# Altium schematic sheet OSP_Carrier_V8_Misc.SchDoc: OSP_Carrier_V8
size B; ApprovedBy: HARI; Engineer: LP; Organization: THE_Lab; DocumentNumber: 1; Revision: 1; SheetNumber: 1; SheetTotal: 1
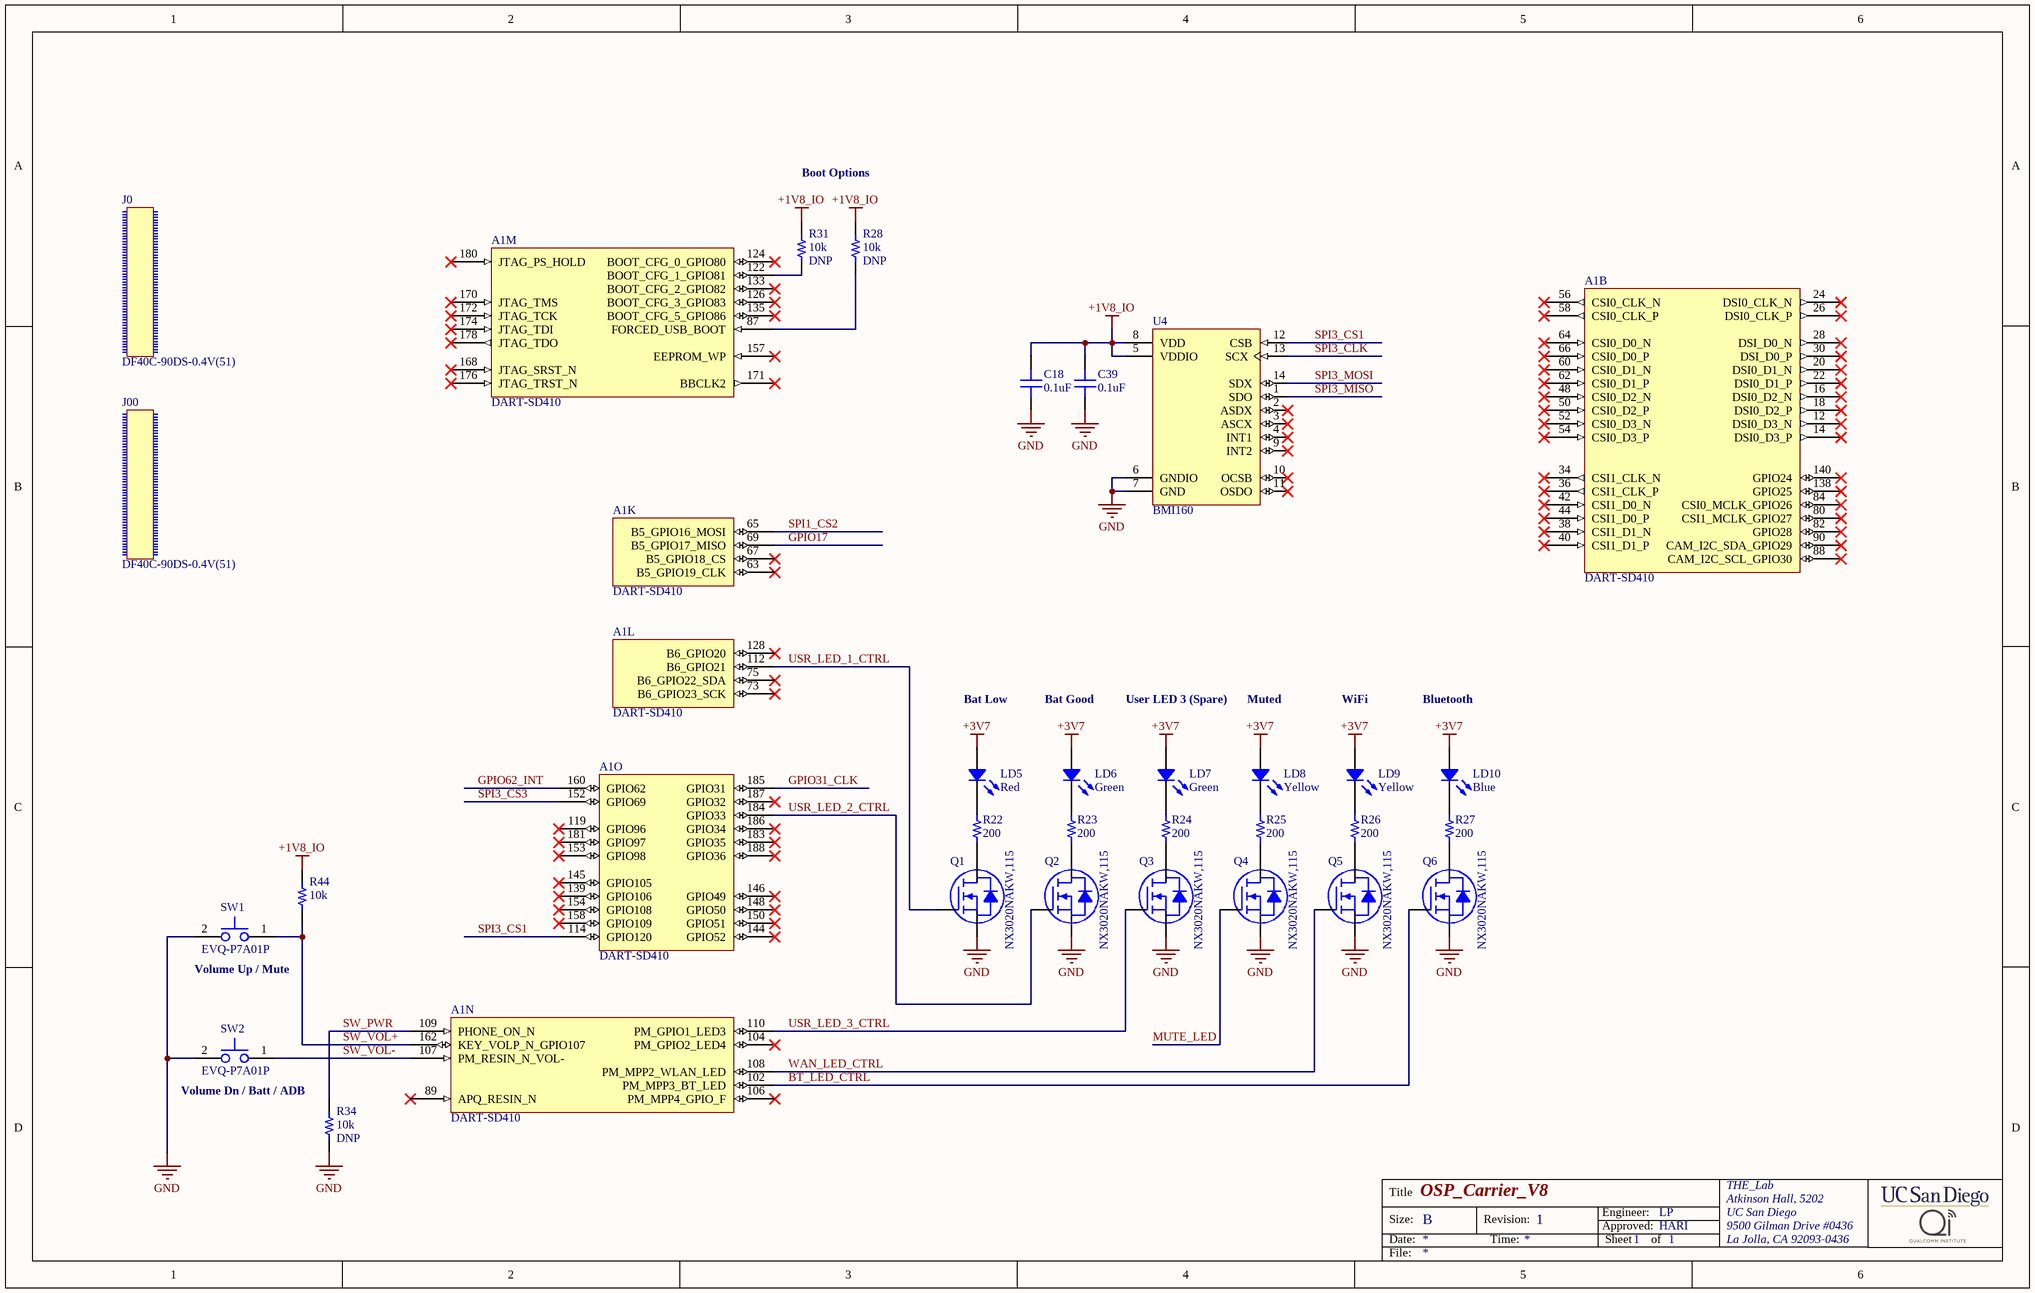
[diagram p0: OSP_Carrier_V8_Misc.SchDoc]

## Parts
A1  DART-SD410  [DART-SD410]  (parts B,K,L,M,N,O of 15)
C18  0.1uF  [CAP 0402/1005]
C39  0.1uF  [CAP 0402/1005]
J0  DF40C-90DS-0.4V(51)  [Hirose_DF40C-90DS-0.4V(51)]
J00  DF40C-90DS-0.4V(51)  [Hirose_DF40C-90DS-0.4V(51)]
LD5  Red  [LED 0603/1608 RED]
LD6  Green  [LED 0603/1608 GREEN]
LD7  Green  [LED 0603/1608 GREEN]
LD8  Yellow  [LED 0603/1608 YELLOW]
LD9  Yellow  [LED 0603/1608 YELLOW]
LD10  Blue  [LED 0603/1608 BLUE]
Q1  NX3020NAKW,115  [NXP SOT-323-3]
Q2  NX3020NAKW,115  [NXP SOT-323-3]
Q3  NX3020NAKW,115  [NXP SOT-323-3]
Q4  NX3020NAKW,115  [NXP SOT-323-3]
Q5  NX3020NAKW,115  [NXP SOT-323-3]
Q6  NX3020NAKW,115  [NXP SOT-323-3]
R22  200  [RES 0402/1005]
R23  200  [RES 0402/1005]
R24  200  [RES 0402/1005]
R25  200  [RES 0402/1005]
R26  200  [RES 0402/1005]
R27  200  [RES 0402/1005]
R28  10k  [RES 0402/1005]
R31  10k  [RES 0402/1005]
R34  10k  [RES 0402/1005]
R44  10k  [RES 0402/1005]
SW1  EVQ-P7A01P  [PANASONIC_EVQ-P7A]
SW2  EVQ-P7A01P  [PANASONIC_EVQ-P7A]
U4  BMI160  [BOSCH_LGA14]

## Nets
+1V8_IO: C18.1 C39.1 R28.2 R31.2 R44.2 U4.5(VDDIO) U4.8(VDD)
+3V7: LD5.1 LD6.1 LD7.1 LD8.1 LD9.1 LD10.1
GND: C18.2 C39.2 Q1.3(S) Q2.3(S) Q3.3(S) Q4.3(S) Q5.3(S) Q6.3(S) R34.1 SW1.2 SW2.2 U4.6(GNDIO) U4.7(GND)
BT_LED_CTRL: A1.102(PM_MPP3_BT_LED) Q6.1(G)
GPIO17: A1.69(B5_GPIO17_MISO)
GPIO31_CLK: A1.185(GPIO31)
GPIO62_INT: A1.160(GPIO62)
MUTE_LED: Q4.1(G)
SPI1_CS2: A1.65(B5_GPIO16_MOSI)
SPI3_CLK: U4.13(SCX)
SPI3_CS1: A1.114(GPIO120) U4.12(CSB)
SPI3_CS3: A1.152(GPIO69)
SPI3_MISO: U4.1(SDO)
SPI3_MOSI: U4.14(SDX)
SW_PWR: A1.109(PHONE_ON_N) R34.2
SW_VOL+: A1.162(KEY_VOLP_N_GPIO107) R44.1 SW1.1
SW_VOL-: A1.107(PM_RESIN_N_VOL-) SW2.1
USR_LED_1_CTRL: A1.112(B6_GPIO21) Q1.1(G)
USR_LED_2_CTRL: A1.184(GPIO33) Q2.1(G)
USR_LED_3_CTRL: A1.110(PM_GPIO1_LED3) Q3.1(G)
WAN_LED_CTRL: A1.108(PM_MPP2_WLAN_LED) Q5.1(G)
NetA1_87: A1.87(FORCED_USB_BOOT) R28.1
NetA1_122: A1.122(BOOT_CFG_1_GPIO81) R31.1
NetLD5_2: LD5.2 R22.2
NetLD6_2: LD6.2 R23.2
NetLD7_2: LD7.2 R24.2
NetLD8_2: LD8.2 R25.2
NetLD9_2: LD9.2 R26.2
NetLD10_2: LD10.2 R27.2
NetQ1_2: Q1.2(D) R22.1
NetQ2_2: Q2.2(D) R23.1
NetQ3_2: Q3.2(D) R24.1
NetQ4_2: Q4.2(D) R25.1
NetQ5_2: Q5.2(D) R26.1
NetQ6_2: Q6.2(D) R27.1

Not connected (* = marked no-connect by the designer): A1 12(DSI0_D3_N)* 14(DSI0_D3_P)* 16(DSI0_D2_N)* 18(DSI0_D2_P)* 20(DSI0_D1_N)* 22(DSI0_D1_P)* 24(DSI0_CLK_N)* 26(DSI0_CLK_P)* 28(DSI_D0_N)* 30(DSI_D0_P)* 34(CSI1_CLK_N)* 36(CSI1_CLK_P)* 38(CSI1_D1_N)* 40(CSI1_D1_P)* 42(CSI1_D0_N)* 44(CSI1_D0_P)* 48(CSI0_D2_N)* 50(CSI0_D2_P)* 52(CSI0_D3_N)* 54(CSI0_D3_P)* 56(CSI0_CLK_N)* 58(CSI0_CLK_P)* 60(CSI0_D1_N)* 62(CSI0_D1_P)* 63(B5_GPIO19_CLK)* 64(CSI0_D0_N)* 66(CSI0_D0_P)* 67(B5_GPIO18_CS)* 73(B6_GPIO23_SCK)* 75(B6_GPIO22_SDA)* 80(CSI1_MCLK_GPIO27)* 82(GPIO28)* 84(CSI0_MCLK_GPIO26)* 88(CAM_I2C_SCL_GPIO30)* 89(APQ_RESIN_N)* 90(CAM_I2C_SDA_GPIO29)* 104(PM_GPIO2_LED4)* 106(PM_MPP4_GPIO_F)* 119(GPIO96)* 124(BOOT_CFG_0_GPIO80)* 126(BOOT_CFG_3_GPIO83)* 128(B6_GPIO20)* 133(BOOT_CFG_2_GPIO82)* 135(BOOT_CFG_5_GPIO86)* 138(GPIO25)* 139(GPIO106)* 140(GPIO24)* 144(GPIO52)* 145(GPIO105)* 146(GPIO49)* 148(GPIO50)* 150(GPIO51)* 153(GPIO98)* 154(GPIO108)* 157(EEPROM_WP)* 158(GPIO109)* 168(JTAG_SRST_N)* 170(JTAG_TMS)* 171(BBCLK2)* 172(JTAG_TCK)* 174(JTAG_TDI)* 176(JTAG_TRST_N)* 178(JTAG_TDO)* 180(JTAG_PS_HOLD)* 181(GPIO97)* 183(GPIO35)* 186(GPIO34)* 187(GPIO32)* 188(GPIO36)*; U4 2(ASDX)* 3(ASCX)* 4(INT1)* 9(INT2)* 10(OCSB)* 11(OSDO)*

## Notes on the sheet
- Boot Options
- Bat Low
- Bat Good
- User LED 3 (Spare)
- Muted
- WiFi
- Bluetooth
- (near SW1) Volume Up / Mute
- Volume Dn / Batt / ADB
- Title
- Size:
- Date:
- B
- Revision:
- Time:
- Engineer:
- Approved:
- Sheet
- of
- THE_Lab
- Atkinson Hall, 5202
- UC San Diego
- 9500 Gilman Drive #0436
- La Jolla, CA 92093-0436
- File:

## Library data of the parts
A1 = DART-SD410: Variscite DART-SD410 System on Module
C18 C39 = C1005X7R1H104K050BB: CAP CER 0.1UF 50V X7R 0402; Manufacturer: TDK Corporation; TemperatureRange: -55C ~ 125C; Tolerance: 10%; Value: 0.1uF; Part Number: C1005X7R1H104K050BB; PartId: 3860; Supplier 1: Digi-Key; Supplier Part Number 1: 445-5932-2-ND; ComponentLink1Description: Datasheet; ComponentLink1URL: https://product.tdk.com/info/en/catalog/datasheets/mlcc_commercial_general_en.pdf; ComponentLink2Description: Digi-Key listing; ComponentLink2URL: http://digikey.com/product-detail/en/C1005X7R1H104K050BB/445-5932-2-ND/2443410; TemperatureCoefficient: X7R; Voltage: 50V; Price: 0.0287; Type: -; Device Package: 0402 (1005 Metric)
J0 J00 = Dummy_Hirose_SoM_Connector: Hirose DF40C-90DS-0.4V(51) Board-to-Board Connector
LD5 = LTST-C191KRKT: LED RED CLEAR 0603 SMD; Manufacturer: Lite-On Inc.; Value: Green; Millicandela: 54mcd; Voltage Forward: 2V; Current (Test): 20mA; Viewing Angle: 130; Part Number: LTST-C191KRKT; PartId: 7050; Supplier 1: Digi-Key; Supplier Part Number 1: 160-1447-2-ND; ComponentLink1Description: Datasheet; ComponentLink1URL: http://optoelectronics.liteon.com/upload/download/DS22-2000-223/S_110_LTST-C191KRKT.pdf; ComponentLink2Description: Digi-Key Listing; ComponentLink2URL: http://www.digikey.ca/product-detail/en/LTST-C191KRKT/160-1447-2-ND/386837; Price: 0.0521; Device Package: 0603 (1608 Metric); Colour: Red; Lens Transparency: Clear
LD6 LD7 = LTST-C191KGKT: LED GREEN CLEAR 0603 SMD; Manufacturer: Lite-On Inc.; Type: Surface Mount; Millicandela: 35mcd; Voltage Forward: 2V; Current (Test): 20mA; Viewing Angle: 130; Value: Green; Part Number: LTST-C191KGKT; PartId: 7051; Supplier 1: Digi-Key; Supplier Part Number 1: 160-1446-2-ND; ComponentLink1Description: Datasheet; ComponentLink1URL: http://optoelectronics.liteon.com/upload/download/DS22-2000-228/S_110_LTST-C191KGKT.pdf; ComponentLink2Description: Digi-Key Listing; ComponentLink2URL: http://www.digikey.ca/product-detail/en/LTST-C191KGKT/160-1446-2-ND/386835; Price: 0.0521; Device Package: 0603 (1608 Metric); Colour: Green; Lens Transparency: Clear
LD8 LD9 = LTST-C191KSKT: LED YELLOW CLEAR 0603 SMD; Manufacturer: Lite-On Inc.; Value: Green; Type: Surface Mount; Millicandela: 104mcd; Voltage Forward: 2.1V; Current (Test): 20mA; Viewing Angle: 130; Part Number: LTST-C191KSKT; PartId: 7053; Supplier 1: Digi-Key; Supplier Part Number 1: 160-1448-2-ND; ComponentLink1Description: Datasheet; ComponentLink1URL: http://optoelectronics.liteon.com/upload/download/DS22-2000-224/S_110_LTST-C191KSKT.pdf; ComponentLink2Description: Digi-Key Listing; ComponentLink2URL: http://www.digikey.ca/product-detail/en/LTST-C191KSKT/160-1448-2-ND/386839; Price: 0.0555; Device Package: 0603 (1608 Metric); Colour: Yellow; Lens Transparency: Clear
LD10 = LTST-C193TBKT-5A: LED BLUE CLEAR 0603 SMD; Manufacturer: Lite-On Inc.; Value: Green; Type: Surface Mount; Millicandela: 15mcd; Voltage Forward: 2.8V; Current (Test): 5mA; Viewing Angle: 130; Part Number: LTST-C193TBKT-5A; PartId: 7054; Supplier 1: Digi-Key; Supplier Part Number 1: 160-1827-2-ND; ComponentLink1Description: Datasheet; ComponentLink1URL: http://optoelectronics.liteon.com/upload/download/DS22-2004-060/P_100_LTST-C193TBKT-5A.pdf; ComponentLink2Description: Digi-Key Listing; ComponentLink2URL: http://www.digikey.ca/product-detail/en/LTST-C193TBKT-5A/160-1827-2-ND/2053656; Price: 0.0875; Device Package: 0603 (1608 Metric); Colour: Blue; Lens Transparency: Clear
Q1-Q6 = NX3020NAKW,115: MOSFET N-CH 30V 180MA SOT323; Part Number: NX3020NAKW,115
R22-R27 = ERJ-2RKF2000X: RES SMD 200 OHM 1% 1/10W 0402; Manufacturer: Panasonic Electronic Components; TemperatureRange: -55C ~ 155C; TemperatureCoefficient: 100ppm/C; PowerRating: 0.1W, 1/10W; Value: 200; Part Number: ERJ-2RKF2000X; PartId: 12; Supplier 1: Digi-Key; Supplier Part Number 1: P200LTR-ND; ComponentLink1Description: Datasheet; ComponentLink1URL: http://industrial.panasonic.com/www-cgi/jvcr13pz.cgi?E+PZ+3+AOA0002+ERJ2RKF2000X+7+WW; ComponentLink2Description: Digikey listing; ComponentLink2URL: http://digikey.com/product-detail/en/ERJ-2RKF2000X/P200LTR-ND/192215; Tolerance: 1%; Price: 0.0043; Type: Thick Film; Device Package: 0402 (1005 Metric)
R28 R31 R34 R44 = ERJ-2RKF1002X: RES SMD 10K OHM 1% 1/10W 0402; Manufacturer: Panasonic Electronic Components; TemperatureRange: -55C ~ 155C; TemperatureCoefficient: 100ppm/C; PowerRating: 0.1W, 1/10W; Value: 10k; Part Number: ERJ-2RKF1002X; PartId: 1; Supplier 1: Digi-Key; Supplier Part Number 1: P10.0KLTR-ND; ComponentLink1Description: Datasheet; ComponentLink1URL: http://industrial.panasonic.com/www-cgi/jvcr13pz.cgi?E+PZ+3+AOA0002+ERJ2RKF1002X+7+WW; ComponentLink2Description: Digikey listing; ComponentLink2URL: http://digikey.com/product-detail/en/ERJ-2RKF1002X/P10.0KLTR-ND/192073; Tolerance: 1%; Price: 0.0043; Type: Thick Film; Device Package: 0402 (1005 Metric)
  R28 R31 R34: DNP: DNP
SW1 SW2 = PANASONIC_EVQ-P7A01P: Tact Switch SMT Right Angle
U4 = BOSCH_BMI160: BMI160 2.5 x 3 mm Tiaxial Accelerometer / Gyroscope Inertial Measurement Unit